# Altium schematic sheet ExternalRam.SchDoc: STM32 External QSPI RAM
size 431 x 279 mm; Organization: ORGANIZATION; Address1: APPLIED PHYSICS LAB; Address2: UNIVERSITY OF WASHINGTON; Address3: 1013 NE 40TH STREET; Address4: SEATTLE, WA 98105; DocumentNumber: 18; Revision: -; SheetNumber: 18; SheetTotal: 18; ENG_APP_DATE: --/--/--; DSN_APP_DATE: --/--/--; CHK_APP_DATE: --/--/--
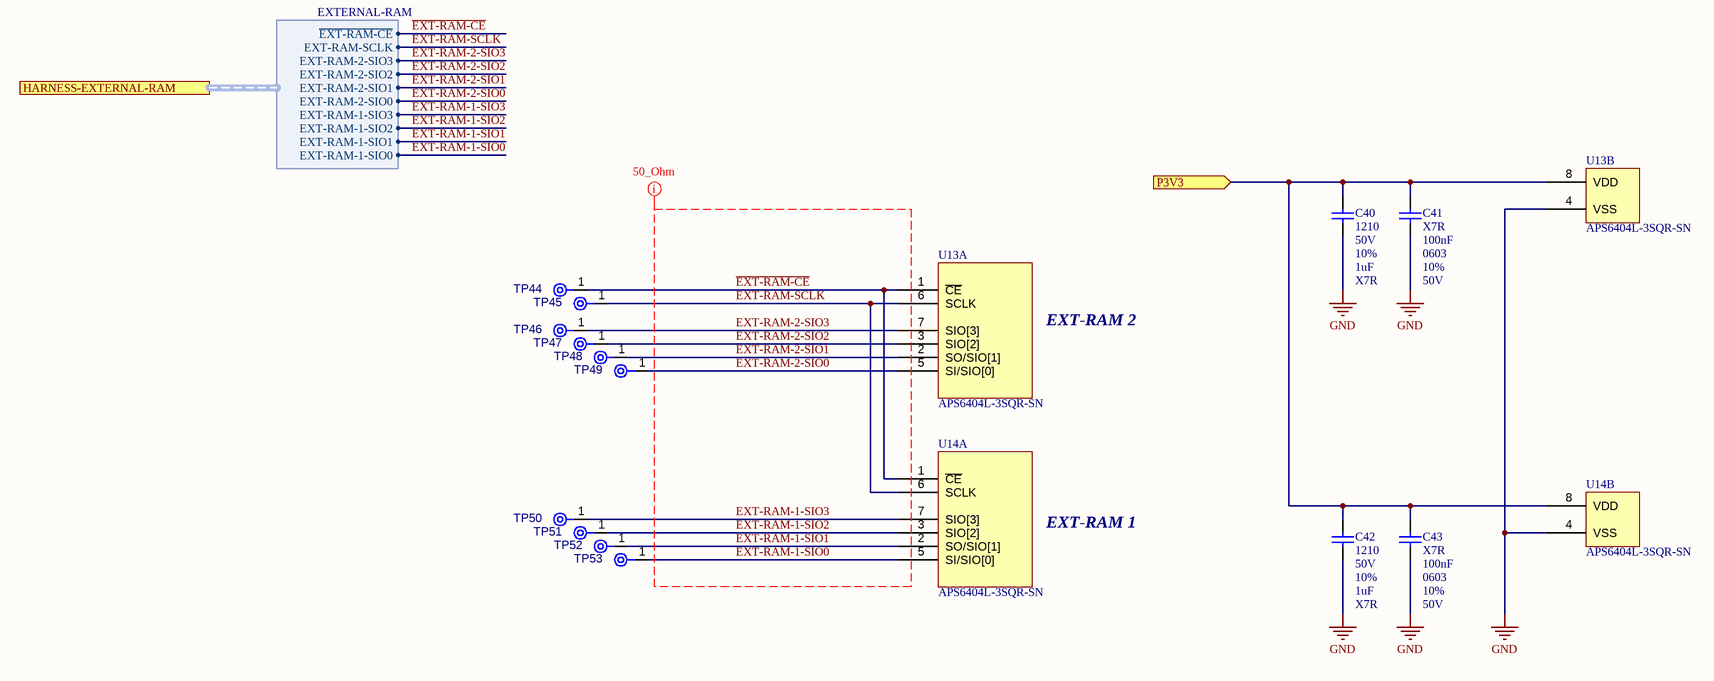
[diagram p0: ExternalRam.SchDoc]

## Parts
C40  value 1uF  Case/Package: 1210  Voltage Rating: 50V  Tolerance: 10%  Dielectric: X7R  [CAPC3225X270X30ML30]  (hidden comment: Capacitor 1uF 10%, 50V, X7R, 1210)
C41  value 100nF  Dielectric: X7R  Case/Package: 0603  Tolerance: 10%  Voltage Rating: 50V  [CAPC1608X90X40ML10T20]  (hidden comment: Capacitor 100nF +/- 10%, 50V, X7R, 0603)
C42  value 1uF  Case/Package: 1210  Voltage Rating: 50V  Tolerance: 10%  Dielectric: X7R  [CAPC3225X270X30ML30]  (hidden comment: Capacitor 1uF 10%, 50V, X7R, 1210)
C43  value 100nF  Dielectric: X7R  Case/Package: 0603  Tolerance: 10%  Voltage Rating: 50V  [CAPC1608X90X40ML10T20]  (hidden comment: Capacitor 100nF +/- 10%, 50V, X7R, 0603)
TP44  TPAD6R-CIRCLED  [TP06R - Circled]  (value not drawn)  (no BOM)
TP45  TPAD6R-CIRCLED  [TP06R - Circled]  (value not drawn)  (no BOM)
TP46  TPAD6R-CIRCLED  [TP06R - Circled]  (value not drawn)  (no BOM)
TP47  TPAD6R-CIRCLED  [TP06R - Circled]  (value not drawn)  (no BOM)
TP48  TPAD6R-CIRCLED  [TP06R - Circled]  (value not drawn)  (no BOM)
TP49  TPAD6R-CIRCLED  [TP06R - Circled]  (value not drawn)  (no BOM)
TP50  TPAD6R-CIRCLED  [TP06R - Circled]  (value not drawn)  (no BOM)
TP51  TPAD6R-CIRCLED  [TP06R - Circled]  (value not drawn)  (no BOM)
TP52  TPAD6R-CIRCLED  [TP06R - Circled]  (value not drawn)  (no BOM)
TP53  TPAD6R-CIRCLED  [TP06R - Circled]  (value not drawn)  (no BOM)
U13  APS6404L-3SQR-SN  [SOP127P600X175-8M]  (parts A,B of 2)
U14  APS6404L-3SQR-SN  [SOP127P600X175-8M]  (parts A,B of 2)

## Ports
HARNESS-EXTERNAL-RAM (harness EXTERNAL-RAM), P3V3 (in)

## Harnesses
EXTERNAL-RAM: EXT-RAM-1-SIO0, EXT-RAM-1-SIO1, EXT-RAM-1-SIO2, EXT-RAM-1-SIO3, EXT-RAM-2-SIO0, EXT-RAM-2-SIO1, EXT-RAM-2-SIO2, EXT-RAM-2-SIO3, EXT-RAM-SCLK, ~{EXT-RAM-CE}

## Nets
GND: C40.1 C41.1 C42.1 C43.1 U13.4(VSS) U14.4(VSS)
~{EXT-RAM-CE}: TP44.1(TP) U13.1(~{CE}) U14.1(~{CE}) ; port HARNESS-EXTERNAL-RAM.~{EXT-RAM-CE}
EXT-RAM-1-SIO0: TP53.1(TP) U14.5(SI/SIO[0]) ; port HARNESS-EXTERNAL-RAM.EXT-RAM-1-SIO0
EXT-RAM-1-SIO1: TP52.1(TP) U14.2(SO/SIO[1]) ; port HARNESS-EXTERNAL-RAM.EXT-RAM-1-SIO1
EXT-RAM-1-SIO2: TP51.1(TP) U14.3(SIO[2]) ; port HARNESS-EXTERNAL-RAM.EXT-RAM-1-SIO2
EXT-RAM-1-SIO3: TP50.1(TP) U14.7(SIO[3]) ; port HARNESS-EXTERNAL-RAM.EXT-RAM-1-SIO3
EXT-RAM-2-SIO0: TP49.1(TP) U13.5(SI/SIO[0]) ; port HARNESS-EXTERNAL-RAM.EXT-RAM-2-SIO0
EXT-RAM-2-SIO1: TP48.1(TP) U13.2(SO/SIO[1]) ; port HARNESS-EXTERNAL-RAM.EXT-RAM-2-SIO1
EXT-RAM-2-SIO2: TP47.1(TP) U13.3(SIO[2]) ; port HARNESS-EXTERNAL-RAM.EXT-RAM-2-SIO2
EXT-RAM-2-SIO3: TP46.1(TP) U13.7(SIO[3]) ; port HARNESS-EXTERNAL-RAM.EXT-RAM-2-SIO3
EXT-RAM-SCLK: TP45.1(TP) U13.6(SCLK) U14.6(SCLK) ; port HARNESS-EXTERNAL-RAM.EXT-RAM-SCLK
P3V3: C40.2 C41.2 C42.2 C43.2 U13.8(VDD) U14.8(VDD) ; port P3V3

## Layout directives
net class 50_Ohm: EXT-RAM-1-SIO0, EXT-RAM-1-SIO1, EXT-RAM-1-SIO2, EXT-RAM-1-SIO3, EXT-RAM-2-SIO0, EXT-RAM-2-SIO1, EXT-RAM-2-SIO2, EXT-RAM-2-SIO3, EXT-RAM-SCLK, ~{EXT-RAM-CE}

## Notes on the sheet
- EXT-RAM 2
- EXT-RAM 1
- THIS DOCUMENT AND THE DATA DISCLOSED HEREIN OR HEREWITH IS THE PROPERTY OF APPLIED PHYSICS LAB - UNIVERSITY OF WASHINGTON.
- PROJECT
- TITLE
- FILE NAME
- SIZE
- B
- CAGE CODE
- DWG NO.
- SHEET
- OF
- REV

## Library data of the parts
C40 C42 = CMP-001-00181-10: Chip Capacitor, 1uF, 10%, 50 V, X7R 1210 (3225 Metric); Capacitor Type: Ceramic; RoHS Compliant: True; Decade: 1uF; Max Operating Temperature: 125°C; Pins: 2; Min Operating Temperature: -55°C; Capacitance: 1uF; Mount: Surface Mount
C41 C43 = CMP-001-00206-10: Chip Capacitor, 100nF, +/- 10%, 50 V, X7R 0603 (1608 Metric); Capacitor Type: Ceramic; Pins: 2; RoHS Compliant: True; Max Operating Temperature: 125°C; Capacitance: 100nF; Min Operating Temperature: -55°C; Decade: 100nF; Mount: Surface Mount
TP44-TP53 = CMP-00028-00014-3: 0.6mm round with a silkscreen circle.; Pins: 1
U13 U14 = CMP-019-00077-5: 8MX8, Cmos, PDSO8; Manufacturer: AP Memory; Min Supply Voltage: 2.7V; Memory Type: PSRAM; Max Clock Frequency: 133MHz; Max Supply Voltage: 3.6V; Interface: QSPI; Density: 64Mb; Max Operating Temperature: +85C; Min Operating Temperature: -40C; Case/Package: SOP-8; Mount: Surface Mount